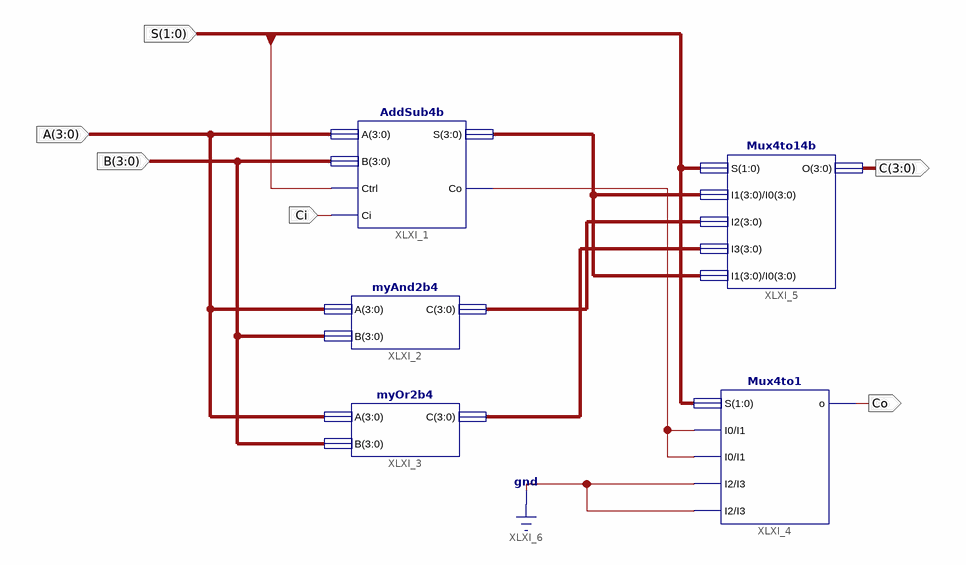
[diagram p0: schematic sheet 1]
// Xilinx ISE schematic ALU4b.sch (kintex7) as structural Verilog: 5 symbols, 6 ports
module ALU4b (
  input  [1:0] S,
  input  [3:0] A,
  input  [3:0] B,
  input  Ci,
  output [3:0] C,
  output Co
);

  wire XLXN_20;
  wire [3:0] XLXN_25, XLXN_26, XLXN_27;

  AddSub4b XLXI_1 (.A(A), .B(B), .Ctrl(S[0]), .S(XLXN_25), .Co(XLXN_20), .Ci(Ci));
  myAnd2b4 XLXI_2 (.A(A), .B(B), .C(XLXN_26));
  myOr2b4 XLXI_3 (.A(A), .B(B), .C(XLXN_27));
  Mux4to1 XLXI_4 (.S(S), .I0(XLXN_20), .I1(XLXN_20), .I2(1'b0), .I3(1'b0), .o(Co));
  Mux4to14b XLXI_5 (.S(S), .I1(XLXN_25), .I2(XLXN_26), .I3(XLXN_27), .I0(XLXN_25), .O(C));
endmodule
